# Altium schematic sheet RTU_LMG_Block_Diagram.SchDoc
size A3; Organization: Altium Limited; Address1: L3, 12a Rodborough Rd; Address2: Frenchs Forest; Address3: NSW; Address4: Australia 2086; SheetNumber: 1; SheetTotal: 16
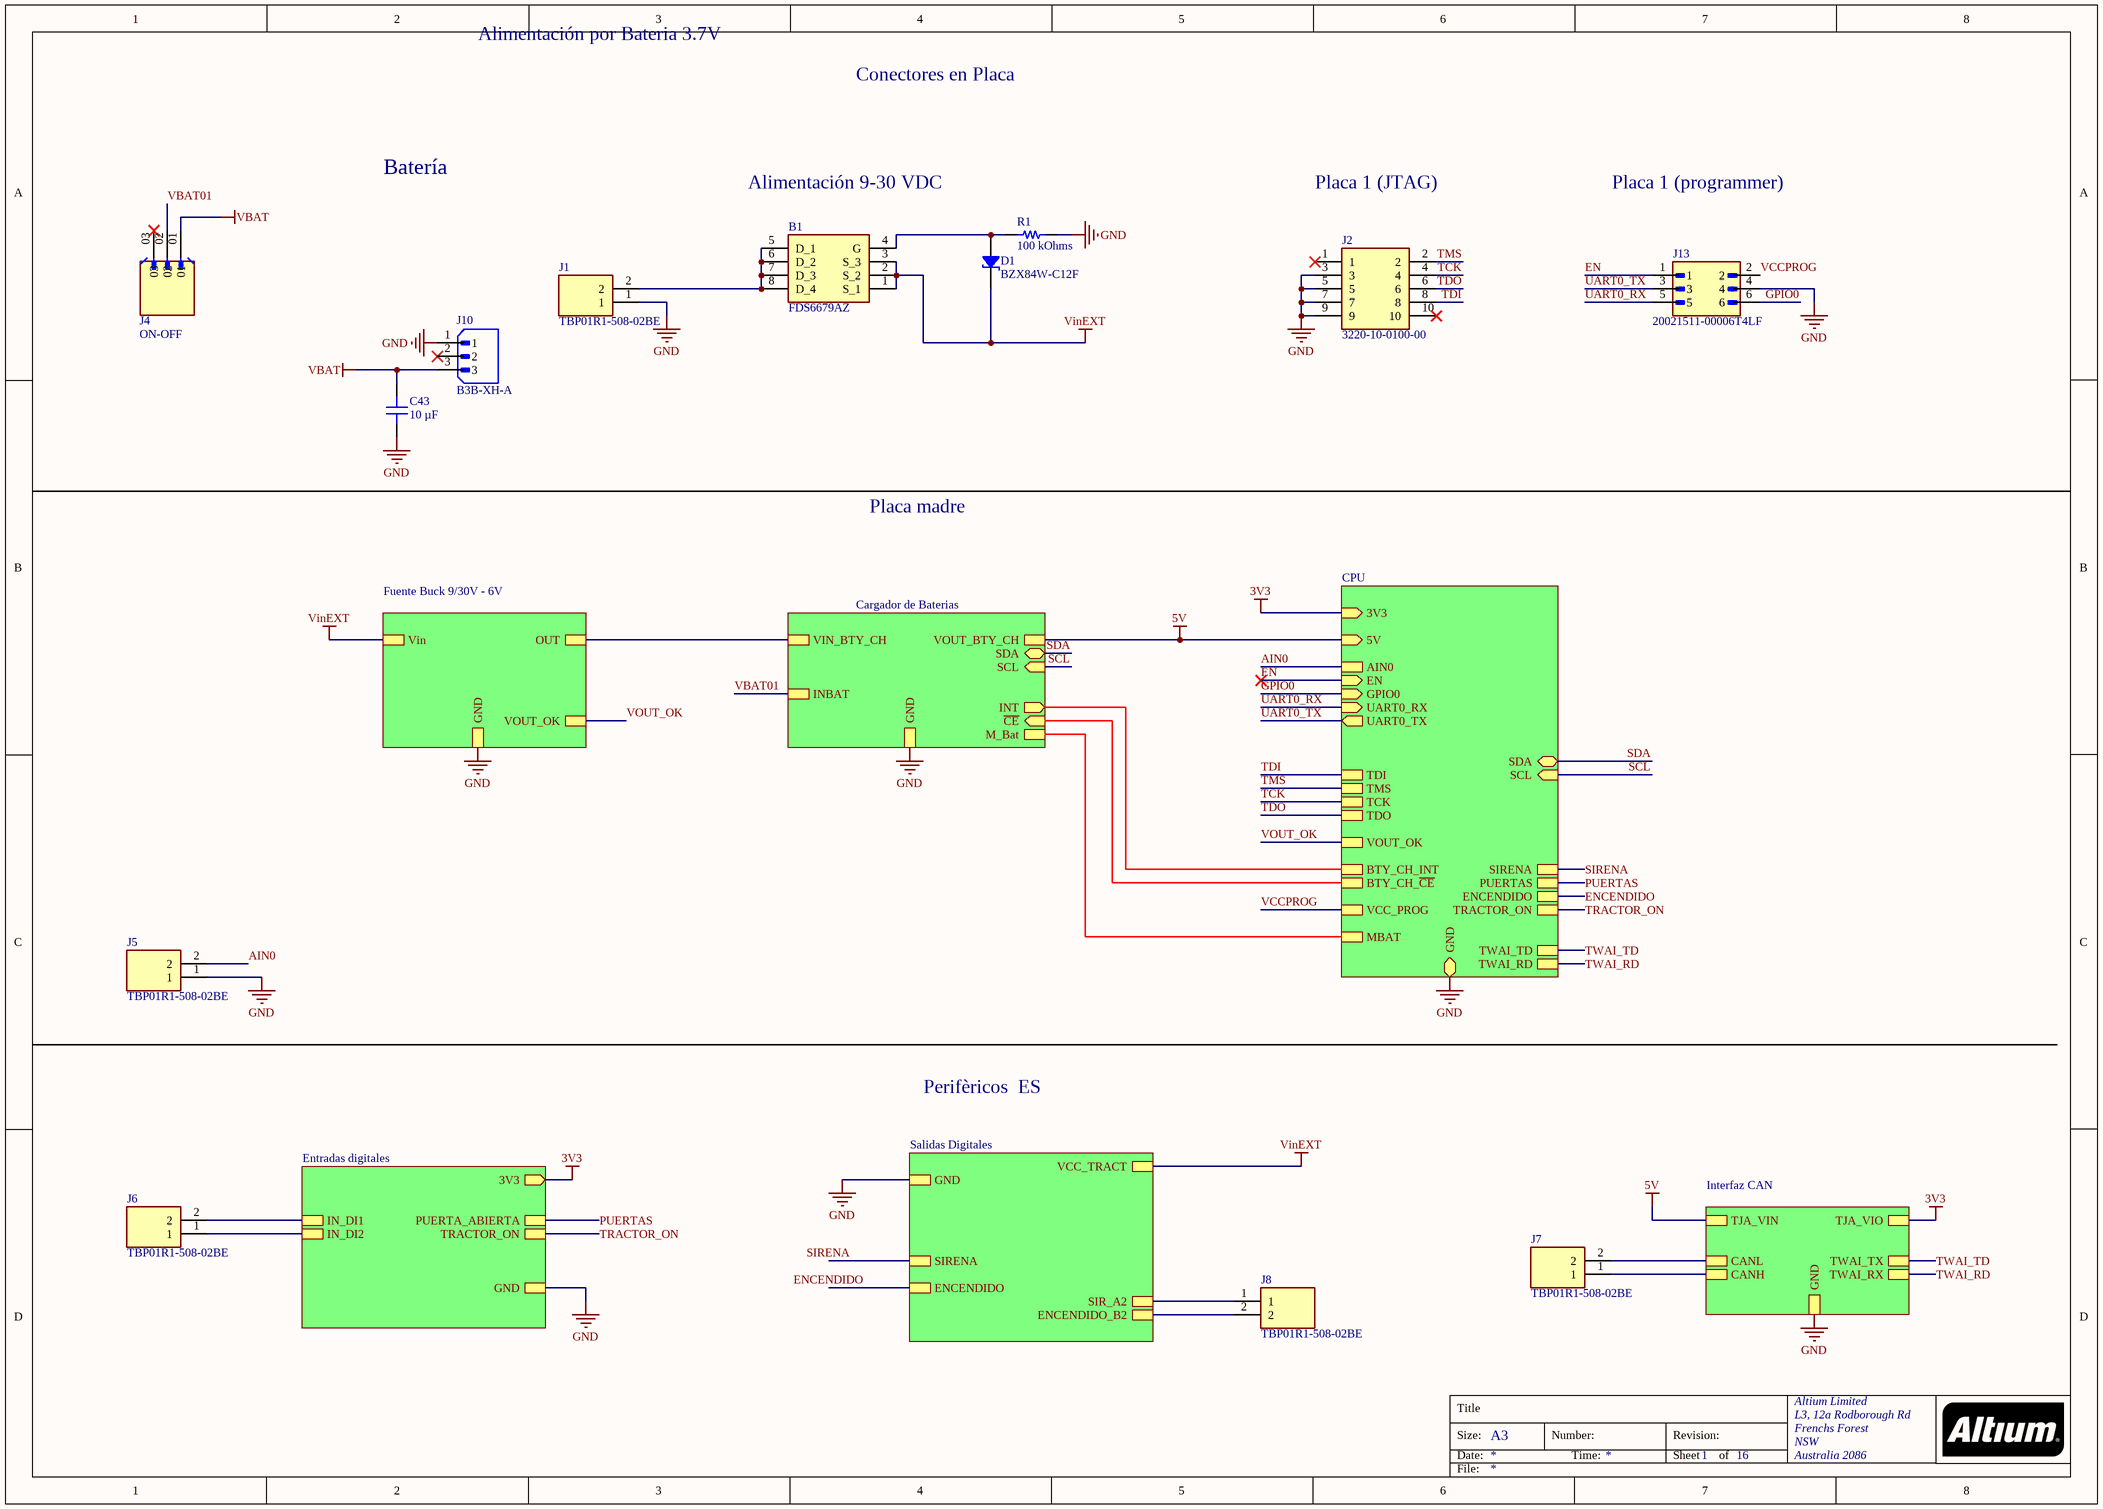
[diagram p0: RTU_LMG_Block_Diagram.SchDoc]

## Parts
B1  FDS6679AZ  [SOIC127P600X175-8N]
C43  10 µF  [YAGEO RES 0805_2012]
D1  BZX84W-C12F  [SOT65P210X110-3N]
J1  TBP01R1-508-02BE  [CUI_TBP01R1-508-02BE]
J2  3220-10-0100-00  [322010010000]
J4  ON-OFF  [AMPHENOL_68001-203HLF]
J5  TBP01R1-508-02BE  [CUI_TBP01R1-508-02BE]
J6  TBP01R1-508-02BE  [CUI_TBP01R1-508-02BE]
J7  TBP01R1-508-02BE  [CUI_TBP01R1-508-02BE]
J8  TBP01R1-508-02BE  [CUI_TBP01R1-508-02BE]
J10  B3B-XH-A  [JST_B3B-XH-A]
J13  20021511-00006T4LF  [AMPHENOL_20021511-00006T4LF]
R1  100 kOhms  [RES 0603_1608]

## Sub-sheets
Cargador de Baterias = RTU_LMG_Battery_Charger.SchDoc: SDA (bidir), SCL (in), INT (out), ~{CE} (in), GND, VIN_BTY_CH, VOUT_BTY_CH, M_Bat, INBAT
CPU = RTU_LMG_CPU.SchDoc: GND (bidir), EN (in), GPIO0 (in), UART0_RX (in), UART0_TX (out), SDA (bidir), SCL (in), TDI, TMS, TCK, TDO, 5V (in), VOUT_OK, BTY_CH_INT, BTY_CH_~{CE}, MBAT, VCC_PROG, 3V3 (in), SIRENA, PUERTAS, ENCENDIDO, TRACTOR_ON, TWAI_TD, TWAI_RD, AIN0
Entradas digitales = RTU_LMG_DI.SchDoc: IN_DI1, PUERTA_ABIERTA, GND, IN_DI2, TRACTOR_ON, 3V3 (out)
Fuente Buck 9/30V - 6V = RTU_LMG_LM2596.SchDoc: Vin, GND, OUT, VOUT_OK
Interfaz CAN = RTU_LMG_CAN.SchDoc: TWAI_TX, TWAI_RX, GND, TJA_VIO, TJA_VIN, CANL, CANH
Salidas Digitales = RTU_LMG_DO.SchDoc: VCC_TRACT, SIR_A2, SIRENA, GND, ENCENDIDO_B2, ENCENDIDO

## Nets
3V3: sheet CPU/3V3, sheet Entradas digitales/3V3, sheet Interfaz CAN/TJA_VIO
5V: sheet CPU/5V, sheet Cargador de Baterias/VOUT_BTY_CH, sheet Interfaz CAN/TJA_VIN
GND: C43.1 J1.1 J2.3 J2.5 J2.7 J2.9 J5.1 J10.1 J13.4 R1.1 ; sheet CPU/GND, sheet Cargador de Baterias/GND, sheet Fuente Buck 9/30V - 6V/GND, sheet Entradas digitales/GND, sheet Salidas Digitales/GND, sheet Interfaz CAN/GND
VBAT: C43.2 J4.01 J10.3
VinEXT: B1.1(S_1) B1.2(S_2) B1.3(S_3) D1.2 ; sheet Fuente Buck 9/30V - 6V/Vin, sheet Salidas Digitales/VCC_TRACT
AIN0: J5.2 ; sheet CPU/AIN0
EN: J13.1 ; sheet CPU/EN
ENCENDIDO: sheet CPU/ENCENDIDO, sheet Salidas Digitales/ENCENDIDO
GPIO0: J13.6 ; sheet CPU/GPIO0
PUERTAS: sheet CPU/PUERTAS, sheet Entradas digitales/PUERTA_ABIERTA
SCL: sheet CPU/SCL, sheet Cargador de Baterias/SCL
SDA: sheet CPU/SDA, sheet Cargador de Baterias/SDA
SIRENA: sheet CPU/SIRENA, sheet Salidas Digitales/SIRENA
TCK: J2.4 ; sheet CPU/TCK
TDI: J2.8 ; sheet CPU/TDI
TDO: J2.6 ; sheet CPU/TDO
TMS: J2.2 ; sheet CPU/TMS
TRACTOR_ON: sheet CPU/TRACTOR_ON, sheet Entradas digitales/TRACTOR_ON
TWAI_RD: sheet CPU/TWAI_RD, sheet Interfaz CAN/TWAI_RX
TWAI_TD: sheet CPU/TWAI_TD, sheet Interfaz CAN/TWAI_TX
UART0_RX: J13.5 ; sheet CPU/UART0_RX
UART0_TX: J13.3 ; sheet CPU/UART0_TX
VBAT01: J4.02 ; sheet Cargador de Baterias/INBAT
VCCPROG: J13.2 ; sheet CPU/VCC_PROG
VOUT_OK: sheet CPU/VOUT_OK, sheet Fuente Buck 9/30V - 6V/VOUT_OK
NetB1_4: B1.4(G) D1.1 R1.2
NetB1_5: B1.5(D_1) B1.6(D_2) B1.7(D_3) B1.8(D_4) J1.2
NetJ6_1: J6.1 ; sheet Entradas digitales/IN_DI2
NetJ6_2: J6.2 ; sheet Entradas digitales/IN_DI1
NetJ7_1: J7.1 ; sheet Interfaz CAN/CANH
NetJ7_2: J7.2 ; sheet Interfaz CAN/CANL
NetJ8_1: J8.1 ; sheet Salidas Digitales/SIR_A2
NetJ8_2: J8.2 ; sheet Salidas Digitales/ENCENDIDO_B2
(unnamed): sheet CPU/BTY_CH_INT, sheet Cargador de Baterias/INT
(unnamed): sheet CPU/BTY_CH_~{CE}, sheet Cargador de Baterias/~{CE}
(unnamed): sheet CPU/MBAT, sheet Cargador de Baterias/M_Bat
(unnamed): sheet Cargador de Baterias/VIN_BTY_CH, sheet Fuente Buck 9/30V - 6V/OUT

Not connected (* = marked no-connect by the designer): J2 1* 10*; J4 03*; J10 2*

## Notes on the sheet
- Alimentación por Bateria 3.7V
- Conectores en Placa
- Batería
- Alimentación 9-30 VDC
- Placa 1 (JTAG)
- Placa 1 (programmer)
- Placa madre
- Perifèricos  ES
- Title
- Size:
- Date:
- A3
- Number:
- Time:
- Revision:
- Sheet
- of
- File:

## Library data of the parts
B1 = FDS6679AZ: Max rDS(on) = 14.8m at VGS = -4.5V, ID = -11A; HBM ESD protection level of 6kV typical (note 3); High power and current handing capability; Extended VGS range (-25V) for battery applications; High performance trench technology for extremely lowrDS(on); High power and current handing capability; Max rDS(on) = 9.3mat VGS = -10V, ID = -13A; Manufacturer_Name: onsemi; Geometry.Height: 1.75mm; Mouser Part Number: 512-FDS6679AZ; Mouser Price/Stock: https://www.mouser.co.uk/ProductDetail/onsemi-Fairchild/FDS6679AZ?qs=vnwGVgFuQiZlXnM8io%2FtYg%3D%3D; Manufacturer_Part_Number: FDS6679AZ; Datasheet Link: https://www.onsemi.com/pub/Collateral/FDS6679AZ-D.PDF
C43 = CL21A106KOQNNNE: CAP CER 10UF 16V X5R 0805; manufacturer: Samsung Electro-Mechanics; Tolerance: ±10%; Part Number: CL21A106KOQNNNE; Value: 10 µF; Applications: General Purpose; Capacitance: 10 µF; componentlink1description: Datasheet; componentlink1url: http://www.samsungsem.com/kr/support/product-search/mlcc/CL21A106KOQNNNE.jsp; componentlink2description: DigiKey Link; componentlink2url: https://www.digikey.com/en/products/detail/samsung-electro-mechanics/CL21A106KOQNNNE/3886754; Device Package: 0805 (2012 Metric); lastupdated: 10/30/2023 7:13:57 PM; Lifecycle Status: Active; Minimum Order: 1; Mounting Type: Surface Mount, MLCC; Operating Temperature: -55°C ~ 85°C; Package / Case: 0805 (2012 Metric); packaging: TapeAndReel; partid: 14297; Part Status: Active; price: 0.01; series: CL; Size / Dimension: 0.079" L x 0.049" W (2.00mm x 1.25mm); Supplier 1: DigiKey; Supplier Part Number 1: 1276-1096-1-ND; Temperature Coefficient: X5R; Thickness (Max): 0.055" (1.40mm); Voltage - Rated: 16V
D1 = BZX84W-C12F: DIODE ZENER 12V 275MW SOT323; Manufacturer: Nexperia USA Inc.; Current - Reverse Leakage @ Vr: 100 nA @ 8 V; Impedance (Max) (Zzt): 25 Ohms; Tolerance: ±5%; Voltage - Forward (Vf) (Max) @ If: 900 mV @ 10 mA; Part Number: BZX84W-C12F; ComponentLink1Description: Datasheet; ComponentLink1URL: https://assets.nexperia.com/documents/data-sheet/BZX84W_SER.pdf; ComponentLink2Description: DigiKey Link; ComponentLink2URL: https://www.digikey.com/en/products/detail/nexperia-usa-inc/BZX84W-C12F/9380703; LastUpdated: 3/6/2024 20:01:46; Lifecycle Status: Active; Minimum Order: 1; Mounting Type: Surface Mount; Operating Temperature: 150°C (TJ); Package / Case: SC-70, SOT-323; Packaging: TapeAndReel; PartId: 873; Part Status: Active; Power - Max: 275 mW; Price: 0.01; Series: BZX84W; Supplier 1: DigiKey; Supplier Part Number 1: 1727-8288-1-ND; Supplier Device Package: SOT-323; Voltage - Zener (Nom) (Vz): 12 V
J1 J5-J8 = TBP01R1-508-02BE: 2~24 Poles, Pluggable, Receptacle, Horizontal, 5.08 Pitch, Terminal Block Connector; MF: Same Sky; SnapEDA_Link: https://www.snapeda.com/parts/TBP01R1-508-02BE/Same+Sky/view-part/?ref=snap; Package: None; Value: *; MP: TBP01R1-508-02BE; Check_prices: https://www.snapeda.com/parts/TBP01R1-508-02BE/Same+Sky/view-part/?ref=eda
J2 = 3220-10-0100-00: Connector Header Through Hole 10 position Shrouded 4 wall 0.050" (1.27mm); Manufacturer_Name: CNC Tech; Datasheet Link: https://datasheet.datasheetarchive.com/originals/dk/DKDS-7/133059.pdf; Height: 5.6mm; Manufacturer_Part_Number: 3220-10-0100-00; Arrow Part Number: 3220-10-0100-00; Arrow Price/Stock: https://www.arrow.com/en/products/3220-10-0100-00/cnc-tech-llc?region=nac
J4 = 68001-203HLF: Board to Board connector, Unshrouded vertical header, Through Hole, Single Row, , 3 Positions, 2.54 mm (0.100in) Pitch.; MF: Amphenol ICC; Package: None; Price: None; Check_prices: https://www.snapeda.com/parts/68001-203HLF/Amphenol+FCI/view-part/?ref=eda; Value: *; SnapEDA_Link: https://www.snapeda.com/parts/68001-203HLF/Amphenol+FCI/view-part/?ref=snap; MP: 68001-203HLF; Availability: In Stock; Purchase-URL: https://pricing.snapeda.com/search?q=68001-203HLF&ref=eda; ComponentLink1Description: New link; ComponentLink1URL: https://www.digikey.com/es/products/detail/amphenol-cs-fci/68001-203HLF/2023312
J10 = B3B-XH-A: Connector Header Through Hole 3 position 0.098 (2.50mm); MF: JST Sales; SnapEDA_Link: https://www.snapeda.com/parts/B3B-XH-A/JST+Sales+America+Inc./view-part/?ref=snap; Package: None; Value: *; MP: B3B-XH-A; Check_prices: https://www.snapeda.com/parts/B3B-XH-A/JST+Sales+America+Inc./view-part/?ref=eda
J13 = 20021511-00006T4LF: 1.27mm (0.05in.) pitch, Shrouded header, 6 contacts; MF: Amphenol ICC (FCI); SnapEDA_Link: https://www.snapeda.com/parts/20021511-00006T4LF/Amphenol+FCI/view-part/?ref=snap; Package: None; Value: *; MP: 20021511-00006T4LF; Check_prices: https://www.snapeda.com/parts/20021511-00006T4LF/Amphenol+FCI/view-part/?ref=eda
R1 = RNCS0603BKE100K: RES 100K OHM 0.1% 1/16W 0603; Manufacturer: Stackpole Electronics Inc; Power (Watts): 0.063W, 1/16W; Temperature Coefficient: ±25ppm/°C; Part Number: RNCS0603BKE100K; Value: 100 kOhms; ComponentLink1Description: Datasheet; ComponentLink1URL: https://www.seielect.com/catalog/sei-rncs_rnch.pdf; ComponentLink2Description: DigiKey Link; ComponentLink2URL: https://www.digikey.com/en/products/detail/stackpole-electronics-inc/RNCS0603BKE100K/1708835; Composition: Thin Film; Device Package: 0603 (1608 Metric); Features: Anti-Corrosive, Automotive AEC-Q200, Moisture Resistant; Height - Seated (Max): 0.022" (0.55mm); LastUpdated: 9/2/2024 20:43:37; Lifecycle Status: Active; Minimum Order: 1; Number of Terminations: 2; Operating Temperature: -55°C ~ 155°C; Package / Case: 0603 (1608 Metric); Packaging: TapeAndReel; PartId: 4849; Part Status: Active; Price: 0.06; Ratings: AEC-Q200; Resistance: 100 kOhms; Series: RNCS; Size / Dimension: 0.061" L x 0.031" W (1.55mm x 0.80mm); Supplier 1: DigiKey; Supplier Part Number 1: RNCS0603BKE100KCT-ND; Supplier Device Package: 0603; Tolerance: ±0.1%